# Altium project ROV_Mainboard.PrjPcb
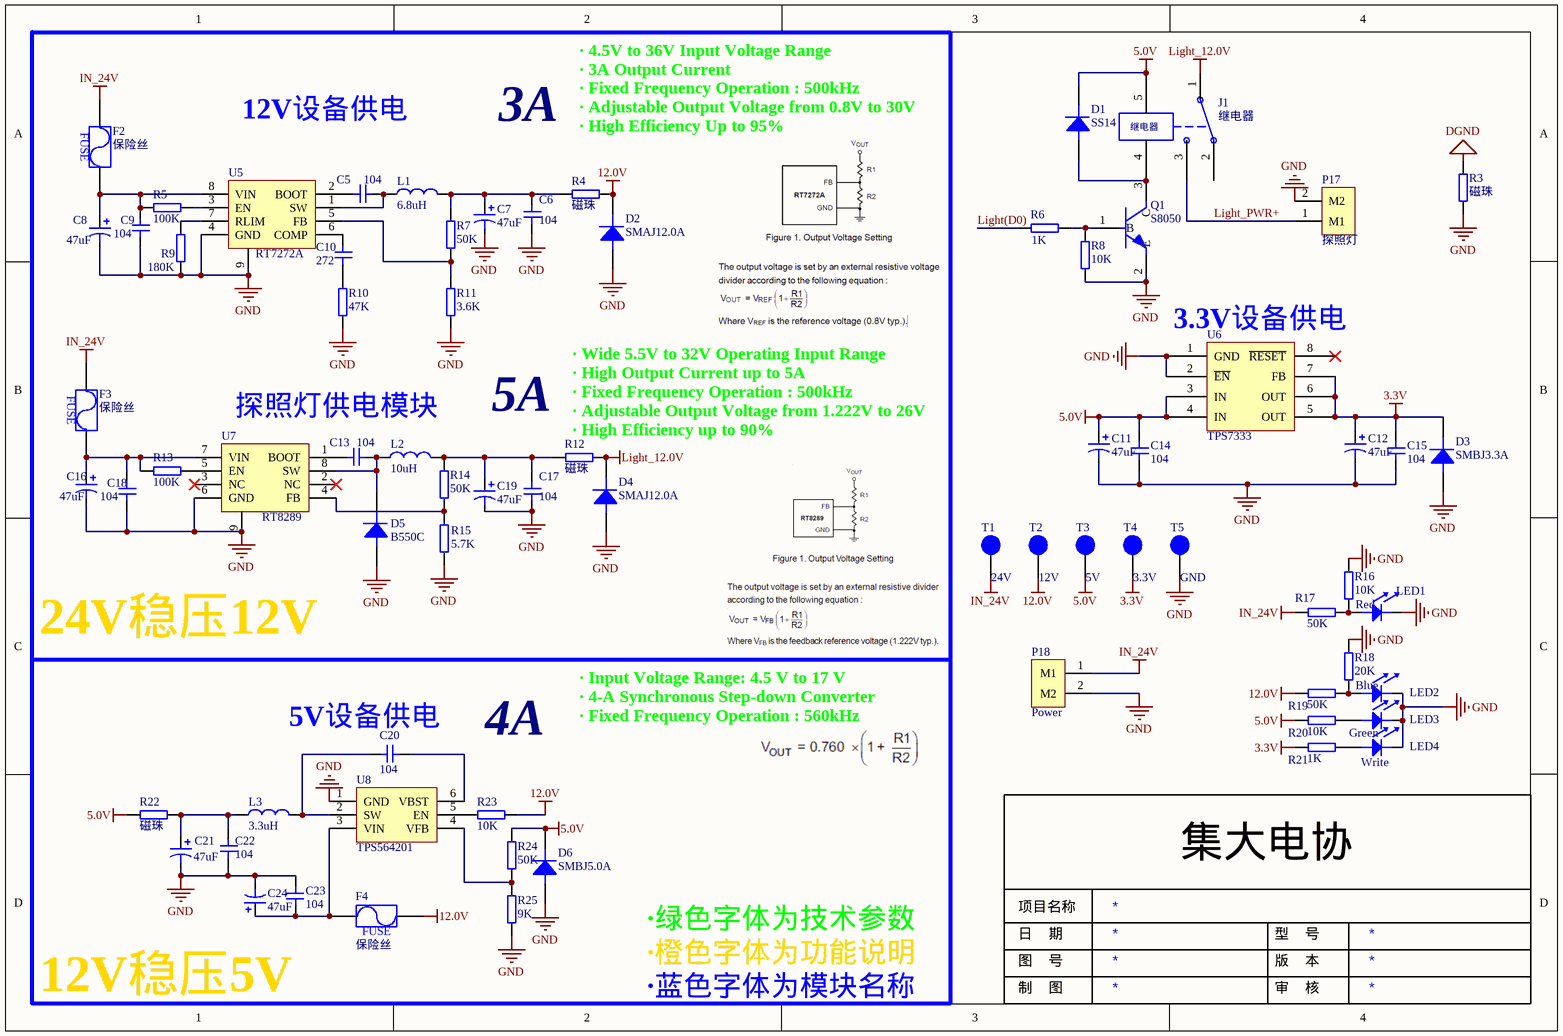
[diagram p0: ROV_Power V2.0.SchDoc]
2 sheets, 100 parts. Net scope: global (net labels, ports and power ports of the same name join across sheets).
Board file: ROV_MainBoard V2.0.PcbDoc
Sheets:
  ROV_Power V2.0.SchDoc
  ROV_MainBoard V2.0.SchDoc

## Sheet ROV_Power V2.0.SchDoc
size A4

### Parts
C5  104  [0805C]
C6  104  [0805C]
C7  47uF  [TAJ-B]
C8  47uF  [TAJ-B]
C9  104  [0805C]
C10  272  [0805C]
C11  47uF  [TAJ-B]
C12  47uF  [TAJ-B]
C13  104  [0805C]
C14  104  [0805C]
C15  104  [0805C]
C16  47uF  [TAJ-B]
C17  104  [0805C]
C18  104  [0805C]
C19  47uF  [TAJ-B]
C20  104  [0805C]
C21  47uF  [TAJ-B]
C22  104  [0805C]
C23  104  [0805C]
C24  47uF  [TAJ-B]
D1  SS14  [SMA/DO-214AC]
D2  SMAJ12.0A  [SMBJ]
D3  SMBJ3.3A  [SMBJ]
D4  SMAJ12.0A  [SMBJ]
D5  B550C  [SMBJ]
D6  SMBJ5.0A  [SMBJ]
F2  保险丝  [1812]
F3  保险丝  [1812]
F4  保险丝  [1812]
J1  继电器  [继电器(小型)]
L1  6.8uH  [电感]
L2  10uH  [电感]
L3  3.3uH  [电感]
LED1  Red  [0805LED(GREEN)]
LED2  Blue  [0805LED(RED)]
LED3  Green  [0805LED(RED)]
LED4  Write  [0805LED(RED)]
P17  探照灯  [KF128-2P]
P18  Power  [XT60-F]
Q1  S8050  [SOT-23]
R3  磁珠  [1210R]
R4  磁珠  [1210R]
R5  100K  [0805R]
R6  1K  [0805R]
R7  50K  [0805R]
R8  10K  [0805R]
R9  180K  [0805R]
R10  47K  [0805R]
R11  3.6K  [0805R]
R12  磁珠  [1210R]
R13  100K  [0805R]
R14  50K  [0805R]
R15  5.7K  [0805R]
R16  10K  [0805R]
R17  50K  [0805R]
R18  20K  [0805R]
R19  50K  [0805R]
R20  10K  [0805R]
R21  1K  [0805R]
R22  磁珠  [1210R]
R23  10K  [0805R]
R24  50K  [0805R]
R25  9K  [0805R]
T1  24V  [测试点(实心)]
T2  12V  [测试点(实心)]
T3  5V  [测试点(实心)]
T4  3.3V  [测试点(实心)]
T5  GND  [测试点(实心)]
U5  RT7272A  [SOP8-Pad]
U6  TPS7333  [SOP-8]
U7  RT8289  [SOP8-Pad]
U8  TPS564201  [SOT23-6]

### Nets
3.3V: C12.1 C15.2 D3.2 R21.1 T4.1 U6.5(OUT) U6.6(OUT) U6.7(FB)
5.0V: C11.1 C14.2 D1.2 D6.2 J1.5 R20.1 R22.2 R24.1 T3.1 U6.3(IN) U6.4(IN)
12.0V: D2.2 F4.2 R4.1 R19.1 R23.1 T2.1
DGND: R3.2
GND: C6.1 C7.2 C8.2 C9.1 C11.2 C12.2 C14.1 C15.1 C16.2 C17.1 C18.1 C19.2 C21.2 C22.1 C23.1 C24.2 D2.1 D3.1 D4.1 D5.1 D6.1 LED1.2 LED2.2 LED3.2 LED4.2 P17.2(M2) P18.2(M2) Q1.2(E) R3.1 R8.1 R9.1 R10.1 R11.1 R15.1 R16.2 R18.2 R25.1 T5.1 U5.4(GND) U5.9(GND) U6.1(GND) U6.2(~{EN}) U7.6(GND) U7.9(GND) U8.1(GND)
IN_24V: F2.1 F3.1 P18.1(M1) R17.1 T1.1
Light_12.0V: D4.2 J1.1 R12.1
Light(D0): R6.2
Light_PWR+: J1.3 P17.1(M1)
NetC5_1: C5.1 L1.1 U5.1(SW)
NetC5_2: C5.2 U5.2(BOOT)
NetC6_2: C6.2 C7.1 L1.2 R4.2 R7.1
NetC8_1: C8.1 C9.2 F2.2 R5.1 U5.8(VIN)
NetC10_1: C10.1 R10.2
NetC10_2: C10.2 U5.6(COMP)
NetC13_1: C13.1 D5.2 L2.1 U7.8(SW)
NetC13_2: C13.2 U7.1(BOOT)
NetC16_1: C16.1 C18.2 F3.2 R13.1 U7.7(VIN)
NetC17_2: C17.2 C19.1 L2.2 R12.2 R14.1
NetC20_1: C20.1 U8.6(VBST)
NetC20_2: C20.2 L3.2 U8.2(SW)
NetC21_1: C21.1 C22.2 L3.1 R22.1
NetC23_2: C23.2 C24.1 F4.1 U8.3(VIN)
NetD1_1: D1.1 J1.4 Q1.3(C)
NetLED1_1: LED1.1 R16.1 R17.2
NetLED2_1: LED2.1 R18.1 R19.2
NetLED3_1: LED3.1 R20.2
NetLED4_1: LED4.1 R21.2
NetQ1_1: Q1.1(B) R6.1 R8.2
NetR5_2: R5.2 U5.3(EN)
NetR7_2: R7.2 R11.2 U5.5(FB)
NetR9_2: R9.2 U5.7(RLIM)
NetR13_2: R13.2 U7.5(EN)
NetR14_2: R14.2 R15.2 U7.4(FB)
NetR23_2: R23.2 U8.5(EN)
NetR24_2: R24.2 R25.2 U8.4(VFB)

Not connected (* = marked no-connect by the designer): J1 2; U6 8(~{RESET})*; U7 2(NC)* 3(NC)*

### Notes on the sheet
- 12V设备供电
- 3A
- · 4.5V to 36V Input Voltage Range
  · 3A Output Current
  · Fixed Frequency Operation : 500kHz
  · Adjustable Output Voltage from 0.8V to 30V
  · High Efficiency Up to 95%
- (near U6) 3.3V设备供电
- 探照灯供电模块
- 5A
- (near R12) · Wide 5.5V to 32V Operating Input Range
  · High Output Current up to 5A
  · Fixed Frequency Operation : 500kHz
  · Adjustable Output Voltage from 1.222V to 26V
  · High Efficiency up to 90%
- 24V稳压12V
- (near C20) 5V设备供电
- 4A
- · Input Voltage Range: 4.5 V to 17 V
  · 4-A Synchronous Step-down Converter
  · Fixed Frequency Operation : 560kHz
- ·绿色字体为技术参数
- ·橙色字体为功能说明
- 12V稳压5V
- ·蓝色字体为模块名称
- 集大电协
- 项目名称
- 日    期
- 图    号
- 版    本
- 型    号
- 制    图
- 审    核
- (in symbol Fuse) FUSE

### Library data of the parts
C5 C6 C9 C10 C13-C15 C17 C18 C20 C22 C23 = Cap1: 无极贴片电容
C7 C8 C11 C12 C16 C19 C21 C24 = Pol Cap: 极性贴片电容
D1-D6 = Diode: 二极管
F2-F4 = Fuse
L1-L3 = L: 电感
LED1-LED4 = LED: 发光二极管
P17 P18 = 接线端子-2PIN: 2PIN
Q1 = NPN: NPN三极管
R3-R25 = Res: 电阻
T1-T5 = 测试点
U6 = TPS7333: 3.3V电源芯片

## Sheet ROV_MainBoard V2.0.SchDoc: ROV_MainBoard
size A4; Date: 2019.4.6; ApprovedBy: 10; CheckedBy: 淹死的鱼; Author: 淹死的鱼; CompanyName: 9; DrawnBy: 淹死的鱼; Engineer: 淹死的鱼; Organization: 5; Address1: ROV; Address2: V1.0; Address4: 12; DocumentNumber: V1.1; Revision: 3; SheetNumber: 2; SheetTotal: 1; CurrentTime: 2019.4.6; CurrentDate: 2019.4.6; Time: 2019.4.6; DocumentFullPathAndName: 8; DocumentName: 7; ModifiedDate: 6; ImagePath: C:\Users\zengwangfa\Pictures\Saved Pictures\电协logo重绘（10000像素版）.png; ProjectName: 4; Application_BuildNumber: 11
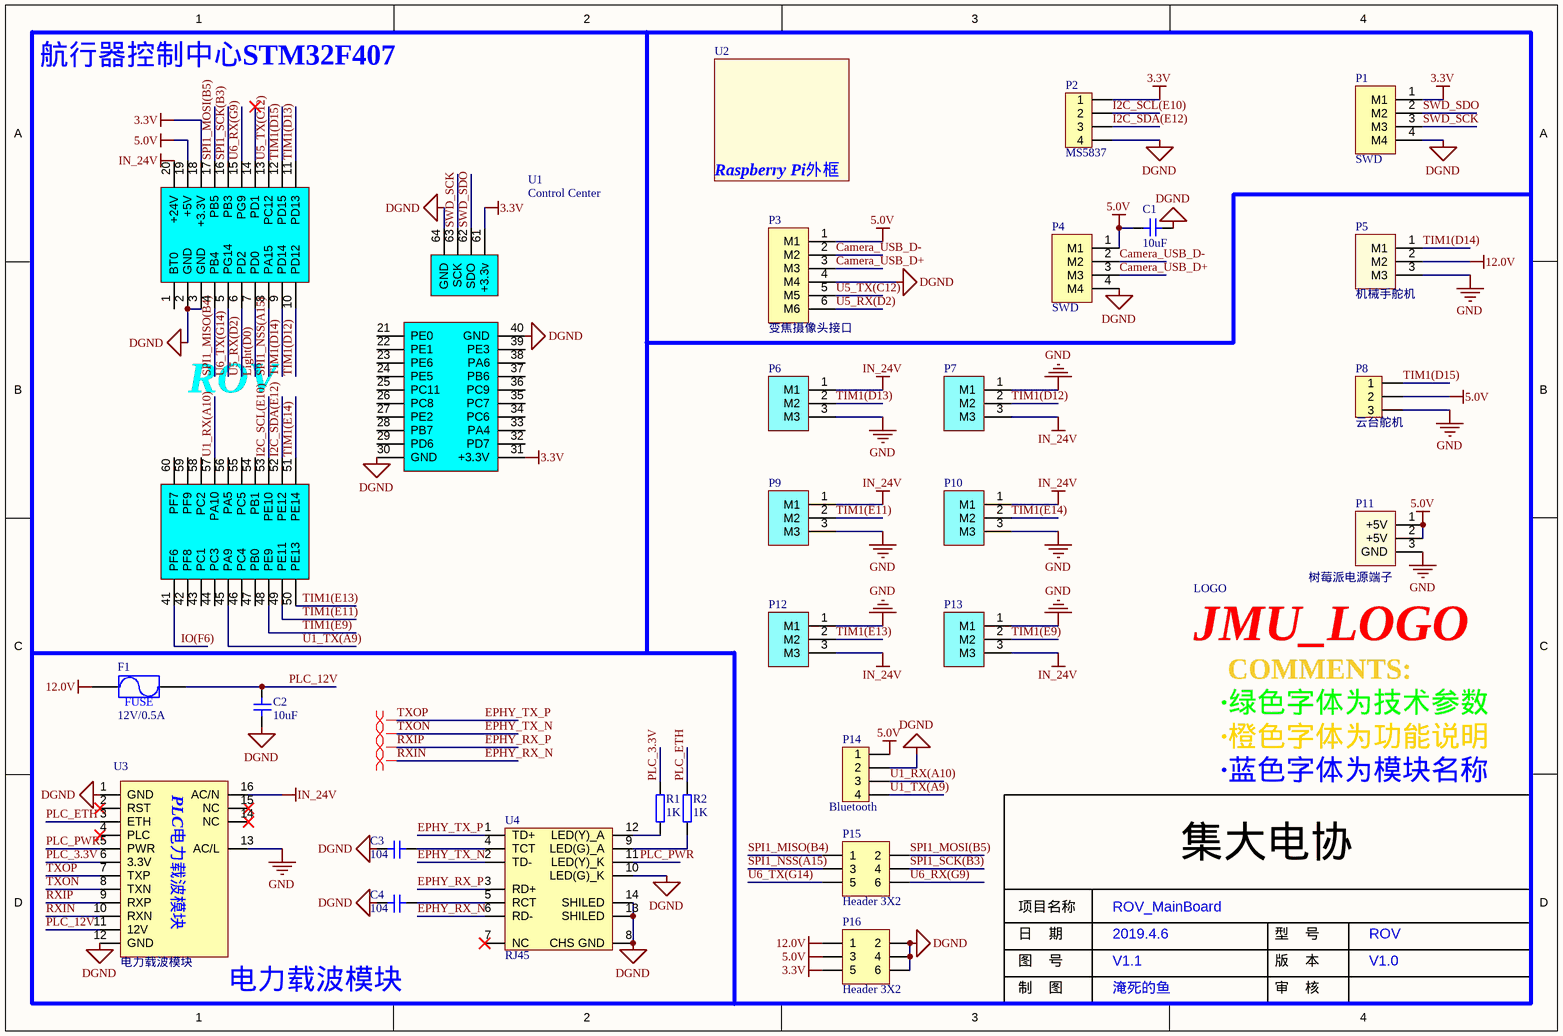
[diagram p1: ROV_MainBoard V2.0.SchDoc]

### Parts
C1  10uF  [0805C]
C2  10uF  [1206C]
C3  104  [0805C]
C4  104  [0805C]
F1  12V/0.5A  [FUSE-1206]
LOGO  (no value)  [JMU_LOGO(1.35cm)]
P1  SWD  [XH4/2.54mm/180]
P2  MS5837  [MX1.25-4PIN]
P3  变焦摄像头接口  [XH6/2.54mm/180]
P4  SWD  [XH4/2.54mm/180]
P5  机械手舵机  [KF128-3P]
P6  (no value)  [KF2EDGK5.0-3P]
P7  (no value)  [KF2EDGK5.0-3P]
P8  云台舵机  [HEADER 3H]
P9  (no value)  [KF2EDGK5.0-3P]
P10  (no value)  [KF2EDGK5.0-3P]
P11  树莓派电源端子  [XH3/2.54mm/180]
P12  (no value)  [KF2EDGK5.0-3P]
P13  (no value)  [KF2EDGK5.0-3P]
P14  Bluetooth  [Header 4(排母)]
P15  Header 3X2  [Header 3X2]
P16  Header 3X2  [Header 3X2]
R1  1K  [0805R]
R2  1K  [0805R]
U1  Control Center  [ROV_Control]
U2  (no value)  [Raspberry Pi]
U3  电力载波模块  [电力载波模块6410]
U4  RJ45  [RJ45]

### Nets
3.3V: P1.1(M1) P2.1 P16.5 U1.18(+3.3V) U1.31(+3.3V) U1.61(+3.3v)
5.0V: C1.2 P3.1(M1) P4.1(M1) P8.2 P11.1(+5V) P11.2(+5V) P14.1 P16.3 U1.19(+5V)
12.0V: F1.1 P5.2(M2) P16.1
DGND: C1.1 C2.1 C3.1 C4.1 P1.4(M4) P2.4 P3.4(M4) P4.4(M4) P14.2 P16.2 P16.4 P16.6 U1.2(GND) U1.3(GND) U1.30(GND) U1.40(GND) U1.64(GND) U3.1(GND) U3.12(GND) U4.8(CHS_GND) U4.10(LED(G)_K) U4.13(SHILED) U4.14(SHILED)
GND: P5.3(M3) P6.3(M3) P7.1(M1) P8.3 P9.3(M3) P10.3(M3) P11.3(GND) P12.1(M1) P13.1(M1) U3.13(AC/L)
IN_24V: P6.1(M1) P7.3(M3) P9.1(M1) P10.1(M1) P12.3(M3) P13.3(M3) U1.20(+24V) U3.16(AC/N)
Camera_USB_D+: P3.3(M3) P4.3(M3)
Camera_USB_D-: P3.2(M2) P4.2(M2)
EPHY_RX_N: U3.10(RXN) U4.6(RD-)  [also labelled RXIN]
EPHY_RX_P: U3.9(RXP) U4.3(RD+)  [also labelled RXIP]
EPHY_TX_N: U3.8(TXN) U4.2(TD-)  [also labelled TXON]
EPHY_TX_P: U3.7(TXP) U4.1(TD+)  [also labelled TXOP]
I2C_SCL(E10): P2.2 U1.53(PE10)
I2C_SDA(E12): P2.3 U1.52(PE12)
IO(F6): U1.41(PF6)
Light(D0): U1.7(PD0)
PLC_3.3V: R1.2 U3.6(3.3V)
PLC_12V: C2.2 F1.2 U3.11(12V)
PLC_ETH: R2.1 U3.3(ETH)
PLC_PWR: U3.5(PWR) U4.11(LED(Y)_K)
SPI1_MISO(B4): P15.1 U1.4(PB4)
SPI1_MOSI(B5): P15.2 U1.17(PB5)
SPI1_NSS(A15): P15.3 U1.8(PA15)
SPI1_SCK(B3): P15.4 U1.16(PB3)
SWD_SCK: P1.3(M3) U1.63(SCK)
SWD_SDO: P1.2(M2) U1.62(SDO)
TIM1(D12): P7.2(M2) U1.10(PD12)
TIM1(D13): P6.2(M2) U1.11(PD13)
TIM1(D14): P5.1(M1) U1.9(PD14)
TIM1(D15): P8.1 U1.12(PD15)
TIM1(E9): P13.2(M2) U1.48(PE9)
TIM1(E11): P9.2(M2) U1.49(PE11)
TIM1(E13): P12.2(M2) U1.50(PE13)
TIM1(E14): P10.2(M2) U1.51(PE14)
U1_RX(A10): P14.3 U1.57(PA10)
U1_TX(A9): P14.4 U1.45(PA9)
U5_RX(D2): P3.6(M6) U1.6(PD2)
U5_TX(C12): P3.5(M5) U1.13(PC12)
U6_RX(G9): P15.6 U1.15(PG9)
U6_TX(G14): P15.5 U1.5(PG14)
NetC3_2: C3.2 U4.4(TCT)
NetC4_2: C4.2 U4.5(RCT)
NetR1_1: R1.1 U4.12(LED(Y)_A)
NetR2_2: R2.2 U4.9(LED(G)_A)

Not connected (* = marked no-connect by the designer): U1 1(BT0) 14(PD1)* 21(PE0) 22(PE1) 23(PE6) 24(PE5) 25(PC11) 26(PC8) 27(PE2) 28(PB7) 29(PD6) 32(PD7) 33(PA4) 34(PC6) 35(PC7) 36(PC9) 37(PB6) 38(PA6) 39(PE3) 42(PF8) 43(PC1) 44(PC3) 46(PC4) 47(PB0) 54(PB1) 55(PC5) 56(PA5) 58(PC2) 59(PF9) 60(PF7); U3 2(RST)* 4(PLC)* 14(NC)* 15(NC)*; U4 7(NC)*

### Layout directives
differential pair: EPHY_RX_N, EPHY_RX_P, EPHY_TX_N, EPHY_TX_P

### Notes on the sheet
- 航行器控制中心STM32F407
- ·绿色字体为技术参数
- COMMENTS:
- ·橙色字体为功能说明
- ·蓝色字体为模块名称
- (near U3) 电力载波模块
- 集大电协
- 项目名称
- 日    期
- 图    号
- 版    本
- 型    号
- 制    图
- 审    核
- (in symbol Fuse) FUSE
- (in symbol Raspberry Pi 外框) Raspberry Pi外框
- (in symbol ROV_Controler) ROV
- (in symbol 电力载波模块6410) PLC电力载波模块

### Library data of the parts
C1-C4 = Cap1: 无极贴片电容
F1 = Fuse: 保险丝
LOGO = JMU_LOGO: LOGO
P1 P4 = 接线端子-4PIN: 4PIN
P2 P14 = Header 4: 排针
P3 = 接线端子-6PIN: 6PIN
P5-P7 P9-P13 = 接线端子-3PIN: 3PIN
P8 = Header 3: 排针
P15 P16 = Header 3X2: 双排排针
R1 R2 = Res: 电阻
U1 = ROV_Controler
U2 = Raspberry Pi 外框
U3 = 电力载波模块6410

## Nets that join several sheets
3.3V: ROV_Power V2.0 (8 pins), ROV_MainBoard V2.0 (6 pins)
5.0V: ROV_Power V2.0 (11 pins), ROV_MainBoard V2.0 (9 pins)
12.0V: ROV_Power V2.0 (6 pins), ROV_MainBoard V2.0 (F1.1 P5.2 P16.1)
DGND: ROV_Power V2.0 (R3.2), ROV_MainBoard V2.0 (23 pins)
GND: ROV_Power V2.0 (45 pins), ROV_MainBoard V2.0 (10 pins)
IN_24V: ROV_Power V2.0 (5 pins), ROV_MainBoard V2.0 (8 pins)
Light(D0): ROV_Power V2.0 (R6.2), ROV_MainBoard V2.0 (U1.7)